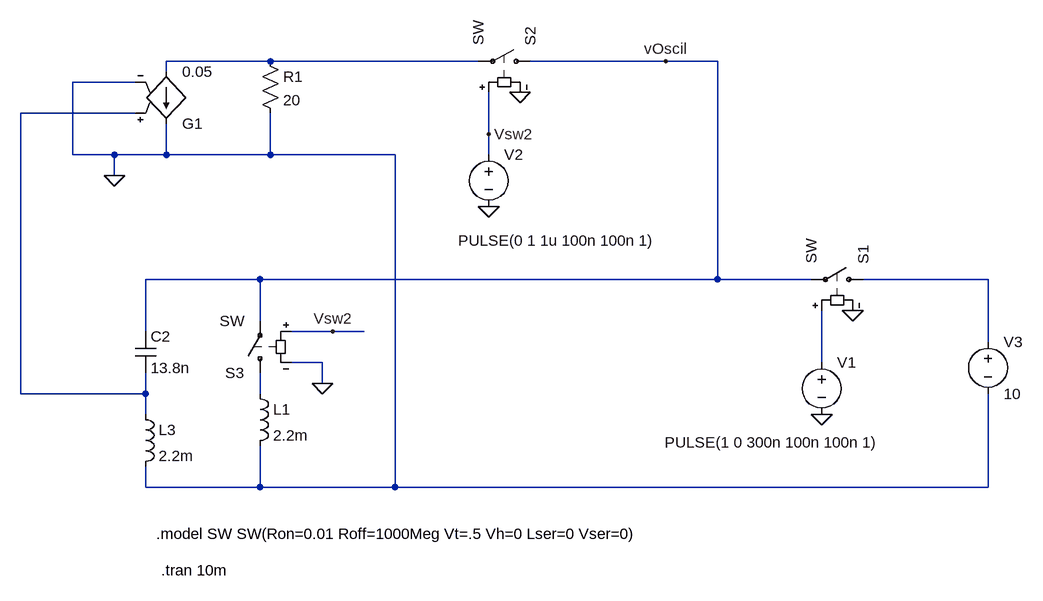
[diagram p0: schematic HartleyIdeal.asc]
HartleyIdeal.asc, the LTspice schematic file:
Version 4
SHEET 1 1196 680
WIRE 32 -272 -128 -272
WIRE 352 -272 32 -272
WIRE 640 -272 432 -272
WIRE 720 -272 640 -272
WIRE -128 -256 -128 -272
WIRE -176 -240 -272 -240
WIRE -176 -192 -352 -192
WIRE 368 -160 368 -224
WIRE -272 -128 -272 -240
WIRE -208 -128 -272 -128
WIRE -128 -128 -128 -176
WIRE -128 -128 -208 -128
WIRE 32 -128 32 -192
WIRE 32 -128 -128 -128
WIRE 224 -128 32 -128
WIRE 368 -128 368 -160
WIRE -208 -96 -208 -128
WIRE 16 64 -160 64
WIRE 720 64 720 -272
WIRE 720 64 16 64
WIRE 864 64 720 64
WIRE 1136 64 944 64
WIRE 16 128 16 64
WIRE -160 144 -160 64
WIRE 128 144 64 144
WIRE 176 144 128 144
WIRE 1136 160 1136 64
WIRE 112 192 64 192
WIRE 880 192 880 112
WIRE 112 224 112 192
WIRE -352 240 -352 -192
WIRE -160 240 -160 208
WIRE -160 240 -352 240
WIRE 16 240 16 208
WIRE -160 272 -160 240
WIRE -160 384 -160 352
WIRE 16 384 16 320
WIRE 16 384 -160 384
WIRE 224 384 224 -128
WIRE 224 384 16 384
WIRE 1136 384 1136 240
WIRE 1136 384 224 384
FLAG -208 -96 0
FLAG 368 -160 Vsw2
FLAG 368 -48 0
FLAG 416 -224 0
FLAG 880 272 0
FLAG 928 112 0
FLAG 640 -272 vOscil
FLAG 112 224 0
FLAG 128 144 Vsw2
SYMBOL ind 0 224 R0
SYMATTR InstName L1
SYMATTR Value 2.2m
SYMBOL sw 960 64 M270
SYMATTR InstName S1
SYMBOL sw 448 -272 M270
SYMATTR InstName S2
SYMBOL voltage 880 176 R0
WINDOW 3 -241 139 Left 2
WINDOW 123 0 0 Left 2
WINDOW 39 0 0 Left 2
SYMATTR Value PULSE(1 0 300n 100n 100n 1)
SYMATTR InstName V1
SYMBOL voltage 368 -144 R0
WINDOW 3 -47 148 Left 2
WINDOW 123 0 0 Left 2
WINDOW 39 0 0 Left 2
SYMATTR Value PULSE(0 1 1u 100n 100n 1)
SYMATTR InstName V2
SYMBOL g -128 -160 M180
SYMATTR InstName G1
SYMATTR Value 0.05
SYMBOL res 16 -288 R0
SYMATTR InstName R1
SYMATTR Value 20
SYMBOL cap -176 144 R0
SYMATTR InstName C2
SYMATTR Value 13.8n
SYMBOL voltage 1136 144 R0
WINDOW 123 0 0 Left 2
WINDOW 39 0 0 Left 2
SYMATTR InstName V3
SYMATTR Value 10
SYMBOL ind -176 256 R0
SYMATTR InstName L3
SYMATTR Value 2.2m
SYMBOL sw 16 224 R180
SYMATTR InstName S3
TEXT -144 456 Left 2 !.model SW SW(Ron=0.01 Roff=1000Meg Vt=.5 Vh=0 Lser=0 Vser=0)
TEXT -136 512 Left 2 !.tran 10m

The netlist it stands for:
* HartleyIdeal.asc
L1 N005 0 2.2m
S1 N003 vOscil N004 0 SW
S2 vOscil N001 Vsw2 0 SW
V1 N004 0 PULSE(1 0 300n 100n 100n 1)
V2 Vsw2 0 PULSE(0 1 1u 100n 100n 1)
G1 N001 0 N002 0 0.05
R1 N001 0 20
C2 vOscil N002 13.8n
V3 N003 0 10
L3 N002 0 2.2m
S3 N005 vOscil Vsw2 0 SW
.model SW SW(Ron=0.01 Roff=1000Meg Vt=.5 Vh=0 Lser=0 Vser=0)
.tran 10m
.backanno
.end